# EAGLE design BaseBoard (EAGLE 9.5.1)
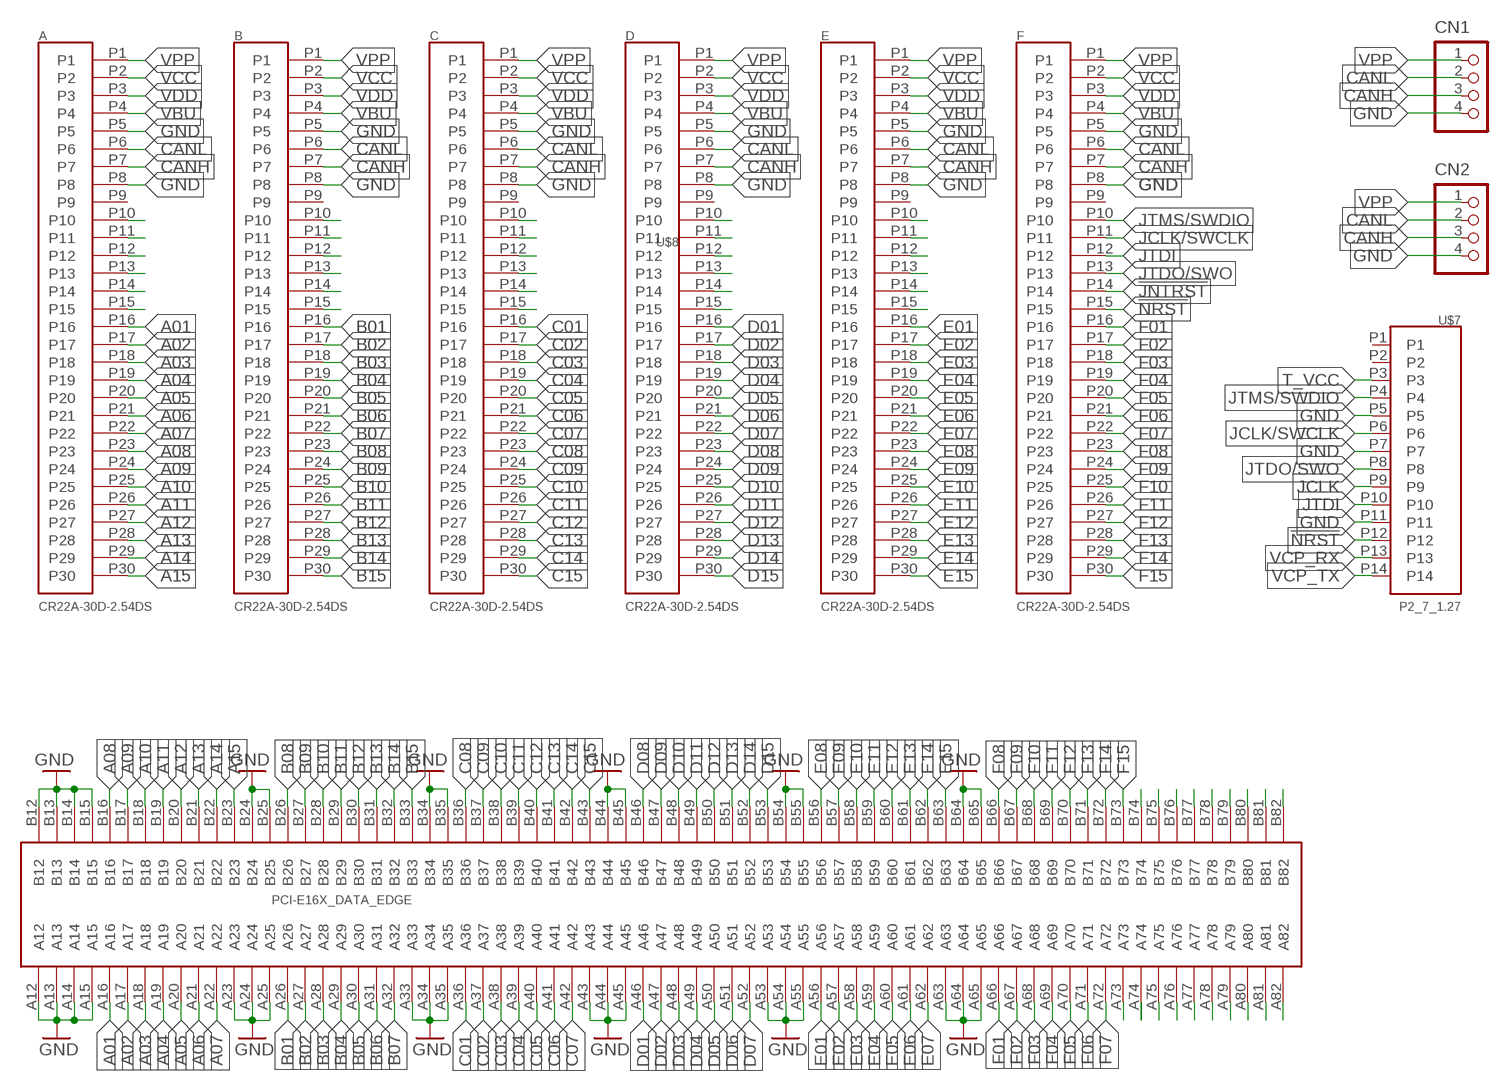
[diagram p0: schematic, sheet 1]

## Parts
A  CR22A-30D-2.54DS  [CR22A-30D-2.54DS]
B  CR22A-30D-2.54DS  [CR22A-30D-2.54DS]
C  CR22A-30D-2.54DS  [CR22A-30D-2.54DS]
CN1  B4B-PH-K-S  [B4B-PH-K-S]
CN2  B4B-PH-K-S  [B4B-PH-K-S]
D  CR22A-30D-2.54DS  [CR22A-30D-2.54DS]
E  CR22A-30D-2.54DS  [CR22A-30D-2.54DS]
F  CR22A-30D-2.54DS  [CR22A-30D-2.54DS]
U$7  P2_7_1.27  [P2_7_1.27]
U$8  PCI-E16X_DATA_EDGE  [PCI-E_164_DATA_EDGE]

## Nets
!JNTRST!: F.P14
!NRST!: F.P15 U$7.P12
A01: A.P16 U$8.A16
A02: A.P17 U$8.A17
A03: A.P18 U$8.A18
A04: A.P19 U$8.A19
A05: A.P20 U$8.A20
A06: A.P21 U$8.A21
A07: A.P22 U$8.A22
A08: A.P23 U$8.B16
A09: A.P24 U$8.B17
A10: A.P25 U$8.B18
A11: A.P26 U$8.B19
A12: A.P27 U$8.B20
A13: A.P28 U$8.B21
A14: A.P29 U$8.B22
A15: A.P30 U$8.B23
B01: B.P16 U$8.A26
B02: B.P17 U$8.A27
B03: B.P18 U$8.A28
B04: B.P19 U$8.A29
B05: B.P20 U$8.A30
B06: B.P21 U$8.A31
B07: B.P22 U$8.A32
B08: B.P23 U$8.B26
B09: B.P24 U$8.B27
B10: B.P25 U$8.B28
B11: B.P26 U$8.B29
B12: B.P27 U$8.B30
B13: B.P28 U$8.B31
B14: B.P29 U$8.B32
B15: B.P30 U$8.B33
C01: C.P16 U$8.A36
C02: C.P17 U$8.A37
C03: C.P18 U$8.A38
C04: C.P19 U$8.A39
C05: C.P20 U$8.A40
C06: C.P21 U$8.A41
C07: C.P22 U$8.A42
C08: C.P23 U$8.B36
C09: C.P24 U$8.B37
C10: C.P25 U$8.B38
C11: C.P26 U$8.B39
C12: C.P27 U$8.B40
C13: C.P28 U$8.B41
C14: C.P29 U$8.B42
C15: C.P30 U$8.B43
CANH: A.P7 B.P7 C.P7 CN1.3 CN2.3 D.P7 E.P7 F.P7
CANL: A.P6 B.P6 C.P6 CN1.2 CN2.2 D.P6 E.P6 F.P6
D01: D.P16 U$8.A46
D02: D.P17 U$8.A47
D03: D.P18 U$8.A48
D04: D.P19 U$8.A49
D05: D.P20 U$8.A50
D06: D.P21 U$8.A51
D07: D.P22 U$8.A52
D08: D.P23 U$8.B46
D09: D.P24 U$8.B47
D10: D.P25 U$8.B48
D11: D.P26 U$8.B49
D12: D.P27 U$8.B50
D13: D.P28 U$8.B51
D14: D.P29 U$8.B52
D15: D.P30 U$8.B53
E01: E.P16 U$8.A56
E02: E.P17 U$8.A57
E03: E.P18 U$8.A58
E04: E.P19 U$8.A59
E05: E.P20 U$8.A60
E06: E.P21 U$8.A61
E07: E.P22 U$8.A62
E08: E.P23 U$8.B56
E09: E.P24 U$8.B57
E10: E.P25 U$8.B58
E11: E.P26 U$8.B59
E12: E.P27 U$8.B60
E13: E.P28 U$8.B61
E14: E.P29 U$8.B62
E15: E.P30 U$8.B63
F01: F.P16 U$8.A66
F02: F.P17 U$8.A67
F03: F.P18 U$8.A68
F04: F.P19 U$8.A69
F05: F.P20 U$8.A70
F06: F.P21 U$8.A71
F07: F.P22 U$8.A72
F08: F.P23 U$8.B66
F09: F.P24 U$8.B67
F10: F.P25 U$8.B68
F11: F.P26 U$8.B69
F12: F.P27 U$8.B70
F13: F.P28 U$8.B71
F14: F.P29 U$8.B72
F15: F.P30 U$8.B73
GND: A.P5 A.P8 B.P5 B.P8 C.P5 C.P8 CN1.4 CN2.4 D.P5 D.P8 E.P5 E.P8 F.P5 F.P8 U$7.P5 U$7.P7 U$7.P11 U$8.A12 U$8.A13 U$8.A14 U$8.A15 U$8.A23 U$8.A24 U$8.A25 U$8.A33 U$8.A34 U$8.A35 U$8.A43 U$8.A44 U$8.A45 U$8.A53 U$8.A54 U$8.A55 U$8.A63 U$8.A64 U$8.A65 U$8.B12 U$8.B13 U$8.B14 U$8.B15 U$8.B24 U$8.B25 U$8.B34 U$8.B35 U$8.B44 U$8.B45 U$8.B54 U$8.B55 U$8.B64 U$8.B65
JCLK: U$7.P9
JCLK/SWCLK: F.P11 U$7.P6
JTDI: F.P12 U$7.P10
JTDO/SWO: F.P13 U$7.P8
JTMS/SWDIO: F.P10 U$7.P4
N$3: B.P10
N$4: B.P11
N$5: B.P12
N$6: B.P13
N$7: B.P14
N$8: B.P15
N$11: A.P10
N$12: A.P11
N$13: A.P12
N$14: A.P13
N$15: A.P14
N$16: A.P15
N$60: C.P10
N$61: C.P11
N$62: C.P12
N$63: C.P13
N$64: C.P14
N$65: C.P15
N$89: D.P10
N$90: D.P11
N$91: D.P12
N$92: D.P13
N$93: D.P14
N$94: D.P15
N$118: E.P10
N$119: E.P11
N$120: E.P12
N$121: E.P13
N$122: E.P14
N$123: E.P15
N$180: U$8.B74
N$181: U$8.B75
N$191: U$8.B76
N$192: U$8.B77
N$193: U$8.B78
N$194: U$8.B79
N$195: U$8.B80
N$196: U$8.B81
N$197: U$8.B82
N$259: U$8.A73
N$260: U$8.A74
N$262: U$8.A75
N$263: U$8.A76
N$264: U$8.A77
N$265: U$8.A78
N$266: U$8.A79
N$267: U$8.A80
N$268: U$8.A81
N$269: U$8.A82
T_VCC: U$7.P3
VBU: A.P4 B.P4 C.P4 D.P4 E.P4 F.P4
VCC: A.P2 B.P2 C.P2 D.P2 E.P2 F.P2
VCP_RX: U$7.P13
VCP_TX: U$7.P14
VDD: A.P3 B.P3 C.P3 D.P3 E.P3 F.P3
VPP: A.P1 B.P1 C.P1 CN1.1 CN2.1 D.P1 E.P1 F.P1
Unconnected: A.P9 B.P9 C.P9 D.P9 E.P9 F.P9 U$7.P1 U$7.P2

## Library data of the parts
A B C D E F = card_edge:CR22A-30D-2.54DS
CN1 CN2 = jst-ph:B4B-PH-*: Wire-to-Board 2.0mm pitch top mount connector Source: http://www.jst-mfg.com/product/pdf/jpn/PH.pdf http://www.jst-mfg.com/product/detail.php?series=199
U$7 = pins:P2_7_1.27
U$8 = con-pci_express(pci-e):PCI-E16X_DATA_EDGE

## Board
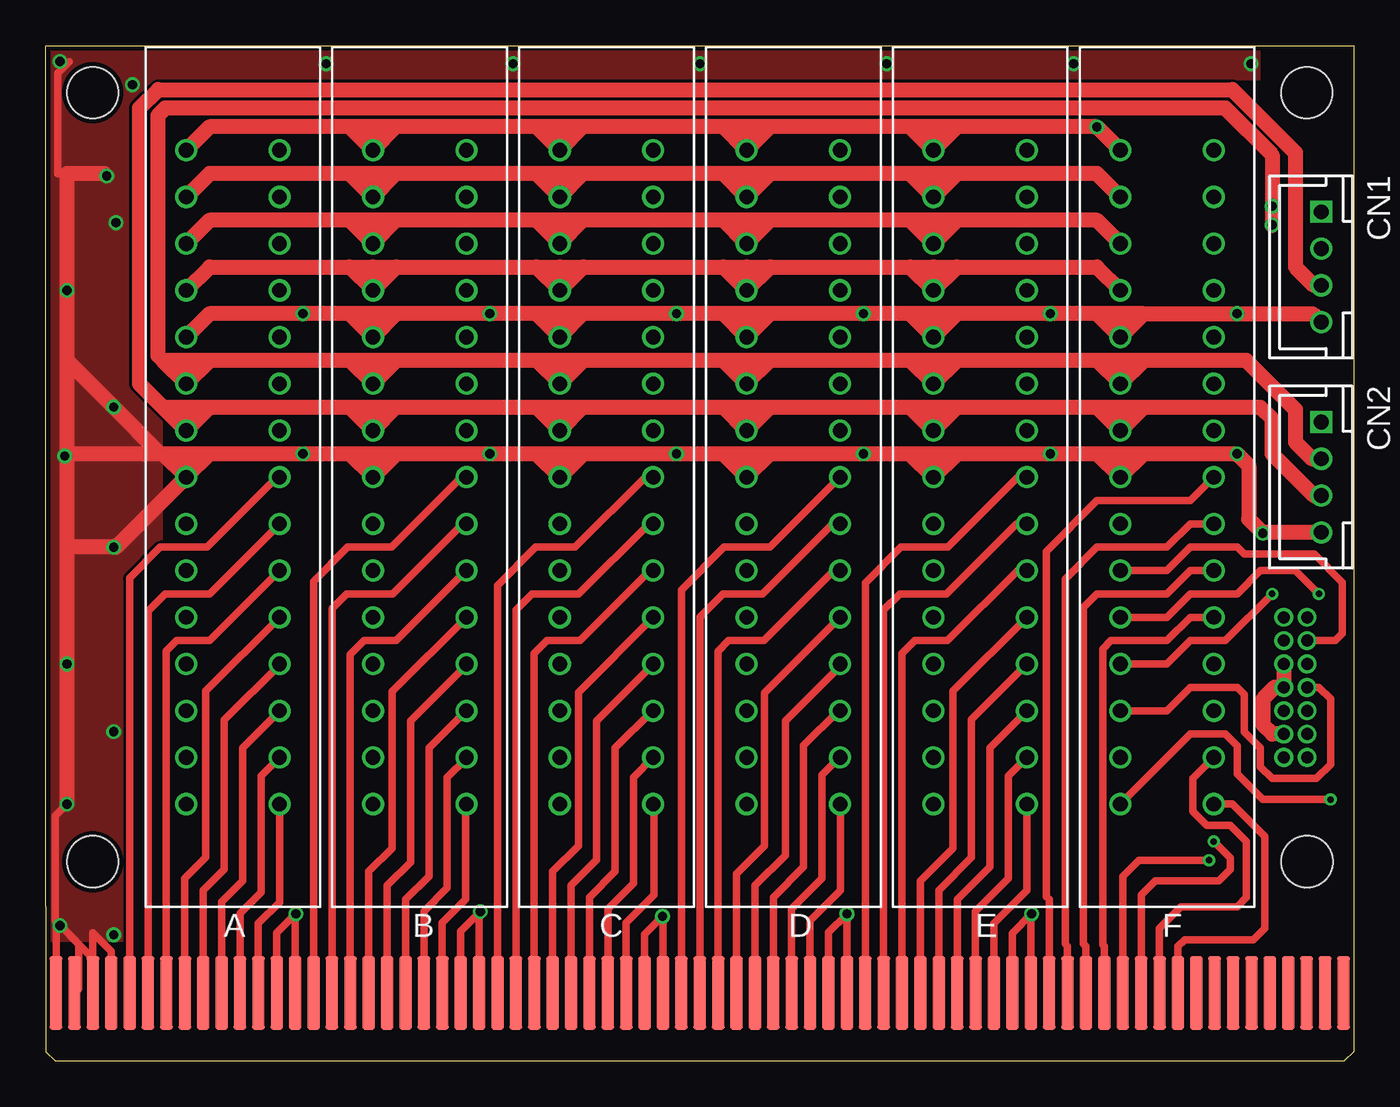
[diagram p1: board, top side]
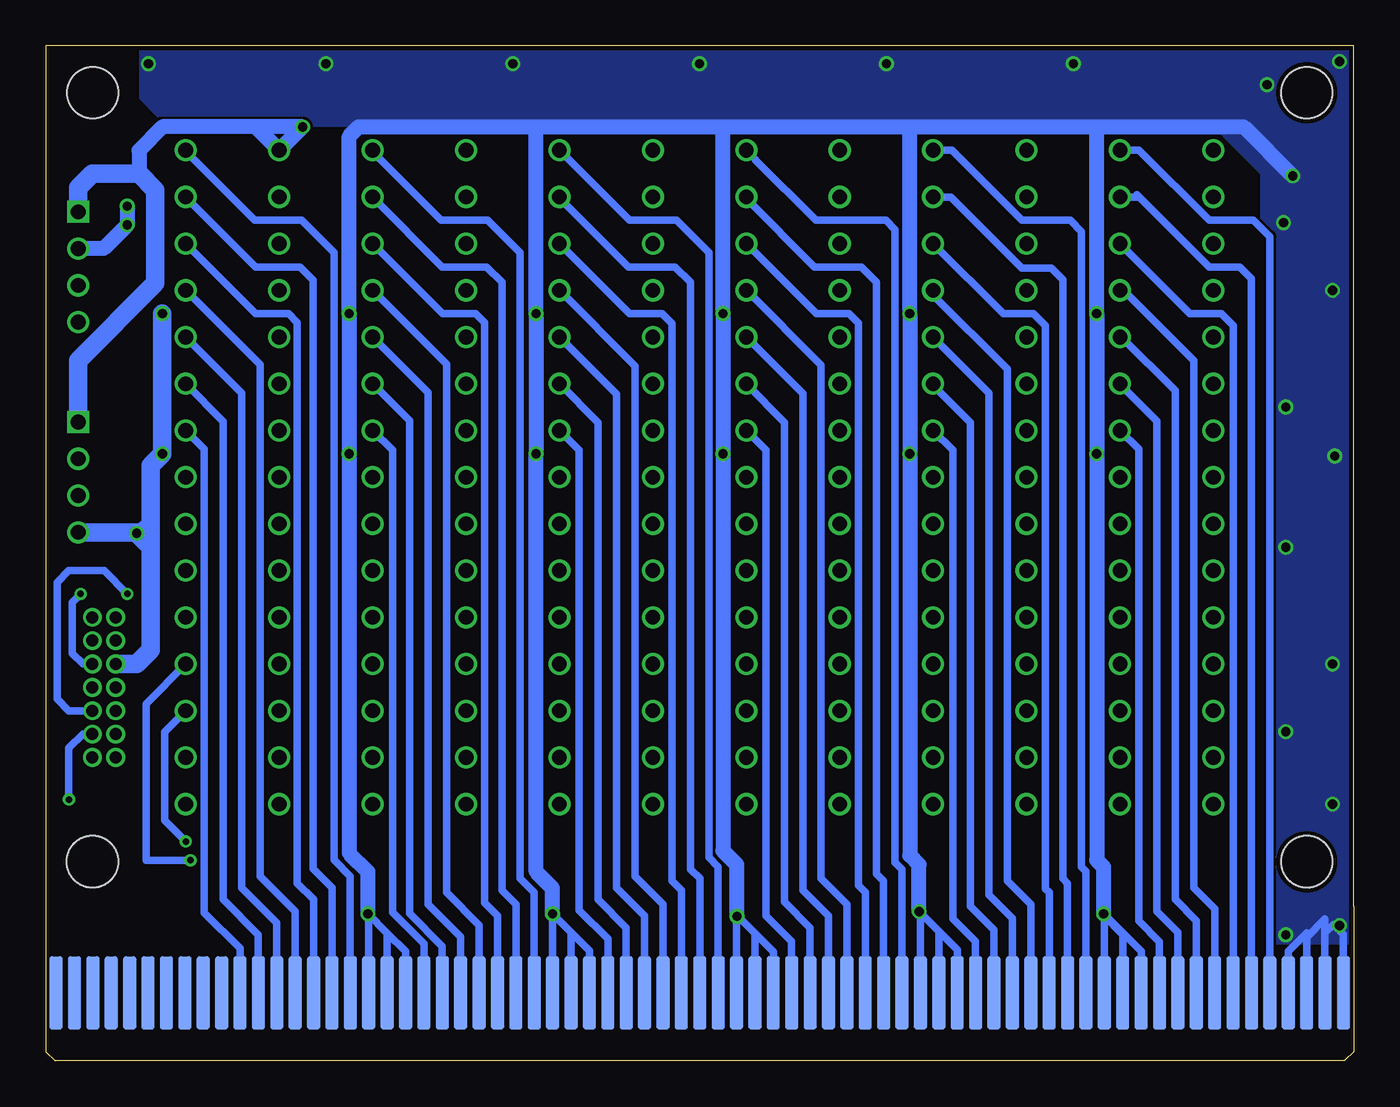
[diagram p2: board, bottom side, seen from below]

Size 71.1 x 55.2 mm. Coordinates in mm from the lower left corner, seen from the top.
Outline: 0,8.4 0,55.2 71.1,55.2 71.1,8.4
Copper layers (1*16): Top 0.035mm / dielectric 1.5mm / Bottom 0.035mm
Design rules "SeeedStudio_2layer_DRU_no_angle_20140221 *": minimum track width 6mil, minimum drill 12mil, track to track 6mil, track to pad 6mil, pad to pad 6mil, via to via 6mil, smd to smd 0mil, copper to edge 10mil, drill to drill 10mil, minimum pad ring 5mil, minimum via ring 6mil, stop-mask expansion 2mil, vias tented up to drill 100mil, thermal gap 10mil
Holes 2.8 mm at 68.56,52.66 68.58,10.84 2.54,52.66 2.54,10.84

### Footprints (pad centres in the part's own frame; a part is rotated, then mirrored left to right if it is on the bottom)
CR22A-30D-2.54DS = drill 0.8: P1 -2.54,17.78; P2 -2.54,15.24; P3 -2.54,12.7; P4 -2.54,10.16; P5 -2.54,7.62; P6 -2.54,5.08; P7 -2.54,2.54; P8 -2.54,0; P9 -2.54,-2.54; P10 -2.54,-5.08; P11 -2.54,-7.62; P12 -2.54,-10.16; P13 -2.54,-12.7; P14 -2.54,-15.24; P15 -2.54,-17.78; P16 2.54,17.78; P17 2.54,15.24; P18 2.54,12.7; P19 2.54,10.16; P20 2.54,7.62; P21 2.54,5.08; P22 2.54,2.54; P23 2.54,0; P24 2.54,-2.54; P25 2.54,-5.08; P26 2.54,-7.62; P27 2.54,-10.16; P28 2.54,-12.7; P29 2.54,-15.24; P30 2.54,-17.78
B4B-PH-K-S = drill 0.8 square: 1 -3,0 | drill 0.8: 2 -1,0; 3 1,0; 4 3,0
P2_7_1.27 = drill 0.65 pad 1.016: P1 0,3.81; P2 1.27,3.81; P3 0,2.54; P4 1.27,2.54; P5 0,1.27; P6 1.27,1.27; P7 0,0; P8 1.27,0; P9 0,-1.27; P10 1.27,-1.27; P11 0,-2.54; P12 1.27,-2.54; P13 0,-3.81; P14 1.27,-3.81
PCI-E_164_DATA_EDGE = smd 0.7 x 4 bottom: A12 0.55,3.7; A13 1.55,3.7; A14 2.55,3.7; A15 3.55,3.7; A16 4.55,3.7; A17 5.55,3.7; A18 6.55,3.7; A19 7.55,3.7; A20 8.55,3.7; A21 9.55,3.7; A22 10.55,3.7; A23 11.55,3.7; A24 12.55,3.7; A25 13.55,3.7; A26 14.55,3.7; A27 15.55,3.7; A28 16.55,3.7; A29 17.55,3.7; A30 18.55,3.7; A31 19.55,3.7; A32 20.55,3.7; A33 21.55,3.7; A34 22.55,3.7; A35 23.55,3.7; A36 24.55,3.7; A37 25.55,3.7; A38 26.55,3.7; A39 27.55,3.7; A40 28.55,3.7; A41 29.55,3.7; A42 30.55,3.7; A43 31.55,3.7; A44 32.55,3.7; A45 33.55,3.7; A46 34.55,3.7; A47 35.55,3.7; A48 36.55,3.7; A49 37.55,3.7; A50 38.55,3.7; A51 39.55,3.7; A52 40.55,3.7; A53 41.55,3.7; A54 42.55,3.7; A55 43.55,3.7; A56 44.55,3.7; A57 45.55,3.7; A58 46.55,3.7; A59 47.55,3.7; A60 48.55,3.7; A61 49.55,3.7; A62 50.55,3.7; A63 51.55,3.7; A64 52.55,3.7; A65 53.55,3.7; A66 54.55,3.7; A67 55.55,3.7; A68 56.55,3.7; A69 57.55,3.7; A70 58.55,3.7; A71 59.55,3.7; A72 60.55,3.7; A73 61.55,3.7; A74 62.55,3.7; A75 63.55,3.7; A76 64.55,3.7; A77 65.55,3.7; A78 66.55,3.7; A79 67.55,3.7; A80 68.55,3.7; A81 69.55,3.7; A82 70.55,3.7 | smd 0.7 x 4: B12 0.55,3.7; B13 1.55,3.7; B14 2.55,3.7; B15 3.55,3.7; B16 4.55,3.7; B17 5.55,3.7; B18 6.55,3.7; B19 7.55,3.7; B20 8.55,3.7; B21 9.55,3.7; B22 10.55,3.7; B23 11.55,3.7; B24 12.55,3.7; B25 13.55,3.7; B26 14.55,3.7; B27 15.55,3.7; B28 16.55,3.7; B29 17.55,3.7; B30 18.55,3.7; B31 19.55,3.7; B32 20.55,3.7; B33 21.55,3.7; B34 22.55,3.7; B35 23.55,3.7; B36 24.55,3.7; B37 25.55,3.7; B38 26.55,3.7; B39 27.55,3.7; B40 28.55,3.7; B41 29.55,3.7; B42 30.55,3.7; B43 31.55,3.7; B44 32.55,3.7; B45 33.55,3.7; B46 34.55,3.7; B47 35.55,3.7; B48 36.55,3.7; B49 37.55,3.7; B50 38.55,3.7; B51 39.55,3.7; B52 40.55,3.7; B53 41.55,3.7; B54 42.55,3.7; B55 43.55,3.7; B56 44.55,3.7; B57 45.55,3.7; B58 46.55,3.7; B59 47.55,3.7; B60 48.55,3.7; B61 49.55,3.7; B62 50.55,3.7; B63 51.55,3.7; B64 52.55,3.7; B65 53.55,3.7; B66 54.55,3.7; B67 55.55,3.7; B68 56.55,3.7; B69 57.55,3.7; B70 58.55,3.7; B71 59.55,3.7; B72 60.55,3.7; B73 61.55,3.7; B74 62.55,3.7; B75 63.55,3.7; B76 64.55,3.7; B77 65.55,3.7; B78 66.55,3.7; B79 67.55,3.7; B80 68.55,3.7; B81 69.55,3.7; B82 70.55,3.7

### Placement (x,y rotation side)
A  10.16,31.75 0 top
B  20.32,31.75 0 top
C  30.48,31.75 0 top
CN1  69.34,43.18 270 top
CN2  69.34,31.75 270 top
D  40.64,31.75 0 top
E  50.8,31.75 0 top
F  60.96,31.75 0 top
U$7  67.31,20.32 0 top
U$8  0,0 0 top

### Tracks (layer width: path | path; a pad name or v marks a point on that pad's centre or on a via)
!NRST!  (via drill 0.35)
  Top 0.406: F.P15 62.23,17.78 64.14,17.78 64.77,17.14 64.77,15.62 66.17,14.22 v69.85,14.22
  Bottom 0.406: v69.85,14.22 69.85,17.02 69.09,17.78 U$7.P12
A01
  Bottom 0.406: A.P16 11.66,49.53 7.85,45.72 5.44,45.72 4.55,44.83 U$8.A16
A02
  Bottom 0.406: A.P17 11.77,46.99 11.77,47.12 7.84,43.18 6.18,43.18 5.55,42.55 U$8.A17
A03
  Bottom 0.406: A.P18 8.89,40.64 7.18,40.64 6.55,40.01 U$8.A18
A04
  Bottom 0.406: A.P19 12.5,41.91 8.69,38.1 8.69,9.41 7.55,8.27 U$8.A19
A05
  Bottom 0.406: A.P20 12.61,39.37 9.69,36.45 9.69,8.78 8.55,7.64 U$8.A20
A06
  Bottom 0.406: A.P21 12.7,36.8 10.69,34.8 10.69,8.14 9.55,7 U$8.A21
A07
  Bottom 0.406: U$8.A22 10.55,6.49 11.68,7.62 11.68,33.27 A.P22
A08
  Top 0.406: A.P23 12.57,31.75 8.76,27.94 6.22,27.94 4.55,26.27 U$8.B16
A09
  Top 0.406: A.P24 8.89,25.4 6.48,25.4 5.55,24.47 U$8.B17
A10
  Top 0.406: U$8.B18 6.55,22.3 7.11,22.86 8.89,22.86 A.P25
A11
  Top 0.406: A.P26 8.69,20.12 8.69,11.07 7.55,9.92 U$8.B19
A12
  Top 0.406: A.P27 12.7,21.55 9.69,18.54 9.69,10.43 8.55,9.29 U$8.B20
A13
  Top 0.406: A.P28 12.7,19.02 10.69,17.02 10.69,9.8 9.55,8.65 U$8.B21
A14
  Top 0.406: A.P29 11.69,15.49 11.69,9.16 10.55,8.02 U$8.B22
A15
  Top 0.406: U$8.B23 11.55,7.49 12.7,8.64 A.P30
B01
  Bottom 0.406: B.P16 21.84,49.53 18.03,45.72 15.41,45.72 14.8,45.12 14.8,10.56 14.55,10.3 U$8.A26
B02
  Bottom 0.406: B.P17 21.9,46.99 18.03,43.12 16.42,43.12 15.8,42.5 15.8,9.92 15.55,9.67 U$8.A27
B03
  Bottom 0.406: B.P18 19.05,40.64 17.4,40.64 16.76,40.01 16.76,9.38 16.55,9.16 U$8.A28
B04
  Bottom 0.406: B.P19 22.86,41.66 18.82,37.62 18.82,9.8 17.55,8.53 U$8.A29
B05
  Bottom 0.406: B.P20 19.82,36.33 19.82,9.03 18.55,7.76 U$8.A30
B06
  Bottom 0.406: B.P21 22.86,36.77 20.82,34.73 20.82,8.4 19.55,7.13 U$8.A31
B07
  Bottom 0.406: B.P22 21.78,33.21 21.78,7.74 20.55,6.51 U$8.A32
B08
  Top 0.406: B.P23 22.59,31.75 18.78,27.94 16.41,27.94 14.55,26.07 U$8.B26
B09
  Top 0.406: B.P24 22.65,29.21 18.84,25.4 16.35,25.4 15.55,24.6 U$8.B27
B10
  Top 0.406: B.P25 22.84,26.67 19.03,22.86 17.3,22.86 16.55,22.11 U$8.B28
B11
  Top 0.406: B.P26 18.82,20.09 18.82,11.57 17.55,10.3 U$8.B29
B12
  Top 0.406: B.P27 22.86,21.54 19.82,18.5 19.82,10.81 18.55,9.54 U$8.B30
B13
  Top 0.406: B.P28 22.84,19.05 20.82,17.03 20.82,10.05 19.55,8.78 U$8.B31
B14
  Top 0.406: B.P29 22.86,16.47 21.82,15.43 21.82,9.41 20.55,8.14 U$8.B32
B15
  Top 0.406: B.P30 22.82,13.93 22.82,8.78 21.55,7.51 U$8.B33
C01
  Bottom 0.406: C.P16 32.51,49.02 32.51,48.99 29.24,45.72 25.43,45.72 24.93,45.22 24.93,10.81 24.55,10.43 U$8.A36
C02
  Bottom 0.406: C.P17 33.02,46.9 29.3,43.18 26.76,43.18 25.93,42.35 25.93,10.18 25.55,9.8 U$8.A37
C03
  Bottom 0.406: C.P18 29.21,40.64 27.43,40.64 26.93,40.14 26.93,9.54 26.55,9.16 U$8.A38
C04
  Bottom 0.406: C.P19 28.95,37.84 28.95,9.92 27.55,8.53 U$8.A39
C05
  Bottom 0.406: C.P20 29.95,36.3 29.95,9.29 28.55,7.89 U$8.A40
C06
  Bottom 0.406: C.P21 33.02,36.8 30.95,34.73 30.95,8.65 29.55,7.26 U$8.A41
C07
  Bottom 0.406: C.P22 31.94,33.21 31.94,7.9 30.55,6.51 U$8.A42
C08
  Top 0.406: C.P23 32.59,31.75 28.78,27.94 26.62,27.94 24.55,25.87 U$8.B36
C09
  Top 0.406: C.P24 32.78,29.21 28.97,25.4 26.43,25.4 25.55,24.52 U$8.B37
C10
  Top 0.406: C.P25 32.84,26.67 29.03,22.86 27.25,22.86 26.55,22.16 U$8.B38
C11
  Top 0.406: C.P26 28.95,20.06 28.95,11.7 27.55,10.3 U$8.B39
C12
  Top 0.406: C.P27 33.02,21.57 29.95,18.5 29.95,10.94 28.55,9.54 U$8.B40
C13
  Top 0.406: C.P28 32.97,19.05 30.95,17.03 30.95,10.3 29.55,8.91 U$8.B41
C14
  Top 0.406: C.P29 31.95,15.43 31.95,9.67 30.55,8.27 U$8.B42
C15
  Top 0.406: C.P30 33.07,13.92 33.07,9.03 31.55,7.51 U$8.B43
CANH
  Top 0.813: CN2.3 68.94,30.75 66.67,33.02 66.67,34.92 66.04,35.56 59.69,35.56 | 6.35,35.56 5.08,36.83 5.08,51.82 6.1,52.83 64.52,52.83 67.94,49.4 67.94,43.18 68.94,42.18 CN1.3 | 6.35,35.56 7.62,35.56 | 7.62,35.56 8.89,35.56 | 8.89,35.56 16.51,35.56 | 16.51,35.56 17.78,35.56 | 17.78,35.56 19.05,35.56 | 19.05,35.56 26.67,35.56 | 26.67,35.56 27.94,35.56 | 27.94,35.56 29.21,35.56 | 29.21,35.56 36.83,35.56 | 36.83,35.56 38.1,35.56 | 38.1,35.56 39.37,35.56 | 39.37,35.56 46.99,35.56 | 46.99,35.56 48.26,35.56 | 48.26,35.56 49.53,35.56 | 49.53,35.56 57.15,35.56 | 57.15,35.56 58.42,35.56 | 58.42,35.56 59.69,35.56 | F.P7 58.42,35.56 | F.P7 59.69,35.56 | F.P7 57.15,35.56 | E.P7 48.26,35.56 | E.P7 49.53,35.56 | E.P7 46.99,35.56 | 39.37,35.56 D.P7 | D.P7 36.83,35.56 | 38.1,35.56 D.P7 | C.P7 27.94,35.56 | C.P7 29.21,35.56 | 26.67,35.56 C.P7 | B.P7 19.05,35.56 | 17.78,35.56 B.P7 | B.P7 16.51,35.56 | A.P7 6.35,35.56 | 7.62,35.56 A.P7 | A.P7 8.89,35.56
CANL  (via drill 0.5)
  Top 0.813: CN2.2 68.85,32.75 67.94,33.66 67.94,35.43 65.28,38.1 59.69,38.1 | 66.67,45.45 v66.67,45.47 v66.67,46.48 66.67,49.28 64.14,51.82 6.48,51.82 6.1,51.44 6.1,38.35 6.35,38.1 | 59.69,38.1 58.42,38.1 | 58.42,38.1 57.15,38.1 | 57.15,38.1 49.53,38.1 | 49.53,38.1 48.26,38.1 | 48.26,38.1 46.99,38.1 | 46.99,38.1 39.37,38.1 | 39.37,38.1 38.1,38.1 | 38.1,38.1 36.83,38.1 | 36.83,38.1 29.21,38.1 | 29.21,38.1 27.94,38.1 | 27.94,38.1 26.67,38.1 | 26.67,38.1 19.05,38.1 | 19.05,38.1 17.78,38.1 | 17.78,38.1 16.51,38.1 | 16.51,38.1 8.89,38.1 | 8.89,38.1 7.62,38.1 | 7.62,38.1 6.35,38.1 | F.P6 59.69,38.1 | 58.42,38.1 F.P6 | F.P6 57.15,38.1 | E.P6 49.53,38.1 | 48.26,38.1 E.P6 | E.P6 46.99,38.1 | 39.37,38.1 D.P6 | D.P6 38.1,38.1 | 36.83,38.1 D.P6 | C.P6 29.21,38.1 | 27.94,38.1 C.P6 | C.P6 26.67,38.1 | B.P6 19.05,38.1 | 17.78,38.1 B.P6 | B.P6 16.51,38.1 | A.P6 8.89,38.1 | A.P6 7.62,38.1 | 6.35,38.1 A.P6
  Bottom 0.813: v66.67,46.48 v66.67,45.47 67.96,44.18 CN1.2
D01
  Bottom 0.406: D.P16 39.37,45.72 36.83,45.72 35.06,43.95 35.06,11.07 34.55,10.56 U$8.A46
D02
  Bottom 0.406: D.P17 43.18,46.93 39.43,43.18 36.89,43.18 36.06,42.35 36.06,10.43 35.55,9.92 U$8.A47
D03
  Bottom 0.406: D.P18 39.37,40.64 37.59,40.64 37.06,40.11 37.06,9.8 36.55,9.29 U$8.A48
D04
  Bottom 0.406: D.P19 39.07,37.8 39.07,10.05 37.55,8.53 U$8.A49
D05
  Bottom 0.406: D.P20 40.07,36.26 40.07,9.41 38.55,7.89 U$8.A50
D06
  Bottom 0.406: D.P21 41.07,34.72 41.07,8.78 39.55,7.26 U$8.A51
D07
  Bottom 0.406: D.P22 42.1,33.21 42.1,8.19 40.55,6.63 U$8.A52
D08
  Top 0.406: D.P23 39.37,27.94 36.88,27.94 34.55,25.61 U$8.B46
D09
  Top 0.406: D.P24 42.78,29.21 38.97,25.4 36.81,25.4 35.55,24.14 U$8.B47
D10
  Top 0.406: D.P25 42.84,26.67 39.03,22.86 37.12,22.86 36.55,22.29 U$8.B48
D11
  Top 0.406: D.P26 39.07,20.02 39.07,11.7 37.55,10.18 U$8.B49
D12
  Top 0.406: D.P27 43.18,21.46 40.2,18.48 40.2,11.19 38.55,9.54 U$8.B50
D13
  Top 0.406: D.P28 43.1,19.05 41.2,17.16 41.2,10.56 39.55,8.91 U$8.B51
D14
  Top 0.406: D.P29 43.16,16.51 42.2,15.55 42.2,9.92 40.55,8.27 U$8.B52
D15
  Top 0.406: D.P30 43.2,13.95 43.2,9.29 41.55,7.64 U$8.B53
E01
  Bottom 0.406: E.P16 53.34,49.44 49.62,45.72 47.08,45.72 45.31,43.95 45.31,9.92 44.55,9.16 U$8.A56
E02
  Bottom 0.406: E.P17 53.34,46.97 49.55,43.18 47.14,43.18 46.31,42.35 46.31,9.29 45.55,8.53 U$8.A57
E03
  Bottom 0.406: E.P18 49.53,40.64 47.75,40.64 47.26,40.15 47.26,8.61 46.55,7.9 U$8.A58
E04
  Bottom 0.406: E.P19 49.33,37.9 49.33,9.16 47.55,7.38 U$8.A59
E05
  Bottom 0.406: E.P20 50.33,36.36 50.33,8.53 48.55,6.75 U$8.A60
E06
  Bottom 0.406: E.P21 51.33,34.82 51.33,8.02 49.55,6.24 U$8.A61
E07
  Bottom 0.406: E.P22 52.26,33.21 52.26,8.09 50.55,6.38 U$8.A62
E08
  Top 0.406: E.P23 52.85,31.75 49.04,27.94 46.5,27.94 44.55,25.99 U$8.B56
E09
  Top 0.406: E.P24 52.78,29.21 48.97,25.4 46.43,25.4 45.55,24.52 U$8.B57
E10
  Top 0.406: E.P25 52.84,26.67 49.03,22.86 47.25,22.86 46.55,22.16 U$8.B58
E11
  Top 0.406: E.P26 49.33,20.12 49.33,11.57 47.55,9.8 U$8.B59
E12
  Top 0.406: E.P27 50.33,18.58 50.33,11.07 48.55,9.29 U$8.B60
E13
  Top 0.406: E.P28 51.33,17.03 51.33,10.56 49.55,8.78 U$8.B61
E14
  Top 0.406: E.P29 52.33,15.5 52.33,9.92 50.55,8.14 U$8.B62
E15
  Top 0.406: E.P30 53.34,9.27 51.55,7.48 U$8.B63
F01
  Bottom 0.406: F.P16 63.5,49.47 59.75,45.72 57.21,45.72 55.44,43.95 55.44,10.94 54.55,10.05 U$8.A66
F02
  Bottom 0.406: F.P17 59.69,43.18 57.28,43.18 56.58,42.48 56.58,10.44 55.55,9.41 U$8.A67
F03
  Bottom 0.406: F.P18 59.69,40.64 57.91,40.64 57.44,40.17 57.44,9.67 56.55,8.78 U$8.A68
F04
  Bottom 0.406: F.P19 59.45,37.87 59.45,10.05 57.55,8.14 U$8.A69
F05
  Bottom 0.406: F.P20 60.45,36.33 60.45,9.41 58.55,7.51 U$8.A70
F06
  Bottom 0.406: F.P21 61.45,34.78 61.45,8.78 59.55,6.88 U$8.A71
F07
  Bottom 0.406: F.P22 62.48,33.27 62.48,8.06 60.55,6.13 U$8.A72
F08
  Top 0.406: F.P23 62.23,30.48 57.15,30.48 54.39,27.72 54.39,8.94 54.55,8.78 U$8.B66
F09
  Top 0.406: F.P24 62.23,29.21 60.96,27.94 57.15,27.94 55.42,26.21 55.42,6.37 55.55,6.24 U$8.B67
F10
  Top 0.406: F.P25 62.23,26.67 60.96,25.4 57.15,25.4 56.42,24.67 56.42,6.37 56.55,6.24 U$8.B68
F11
  Top 0.406: F.P26 62.23,24.13 60.96,22.86 57.91,22.86 57.46,22.41 57.46,6.33 57.55,6.24 U$8.B69
F12  (via drill 0.35)
  Top 0.406: v63.25,10.92 59.44,10.92 58.55,10.04 U$8.B70
  Bottom 0.406: F.P27 65.66,19.43 65.66,10.92 v63.25,10.92
F13  (via drill 0.35)
  Top 0.406: v63.5,11.94 64.39,11.05 64.39,10.41 63.77,9.8 60.31,9.8 59.55,9.03 U$8.B71
  Bottom 0.406: F.P28 64.64,17.91 64.64,13.08 v63.5,11.94
F14
  Top 0.406: F.P29 62.36,15.37 62.36,13.59 63.12,12.83 64.39,12.83 65.28,11.94 65.28,8.89 64.77,8.38 61.72,8.38 60.55,7.21 U$8.B72
F15
  Top 0.406: F.P30 64.52,13.97 66.26,12.22 66.26,7.21 65.66,6.6 61.91,6.6 61.55,6.24 U$8.B73
GND  (via drill 0.5)
  Top 0.406: U$8.A24 12.55,6.96 v13.59,8 13.55,7.96 U$8.A25 | U$8.B34 22.55,7.06 v23.62,8.13 23.55,8.06 U$8.B35 | U$8.B44 32.55,6.9 v33.53,7.87 33.55,7.85 U$8.B45 | U$8.B13 1.78,3.93 1.78,6.35 v0.76,7.37 | U$8.B12 0.55,7.15 v0.76,7.37 | U$8.B14 2.55,5.58 | 2.55,5.58 2.55,6.97 3.55,5.97 U$8.B15 | 2.55,5.58 v0.76,7.37 | v0.76,7.37 0.51,7.62 0.51,13.34 v1.14,13.97 | 1.27,54.36 0.64,53.72 0.64,48.26 1.14,48.26 | U$8.B64 52.55,6.96 v53.59,8 53.55,7.96 U$8.B65 | v43.55,7.99 v43.56,8 | U$8.B55 v43.55,7.99 | U$8.B54 42.55,6.99 v43.55,7.99
  Top 0.813: U$7.P11 66.67,17.78 66.17,18.29 66.17,19.68 66.8,20.32 U$7.P7 U$7.P5 | A.P5 8.89,40.64 v13.97,40.64 16.51,40.64 | 59.69,40.64 58.42,40.64 | 58.42,40.64 57.15,40.64 | 57.15,40.64 v54.61,40.64 49.53,40.64 | 49.53,40.64 48.26,40.64 | 48.26,40.64 46.99,40.64 | 46.99,40.64 v44.45,40.64 39.37,40.64 | 39.37,40.64 38.1,40.64 | 38.1,40.64 36.83,40.64 | 36.83,40.64 v34.29,40.64 29.21,40.64 | 29.21,40.64 27.94,40.64 | 27.94,40.64 26.67,40.64 | 26.67,40.64 v24.13,40.64 19.05,40.64 | 19.05,40.64 17.78,40.64 | 17.78,40.64 16.51,40.64 | 8.89,33.02 A.P8 | 59.69,33.02 v64.77,33.02 65.41,32.38 65.41,29.46 v66.17,28.7 66.22,28.75 CN2.4 | 59.69,33.02 58.42,33.02 | 58.42,33.02 57.15,33.02 | 57.15,33.02 v54.61,33.02 49.53,33.02 | 49.53,33.02 48.26,33.02 | 48.26,33.02 46.99,33.02 | 46.99,33.02 v44.45,33.02 39.37,33.02 | 39.37,33.02 38.1,33.02 | 38.1,33.02 36.83,33.02 | 36.83,33.02 v34.29,33.02 29.21,33.02 | 29.21,33.02 27.94,33.02 | 27.94,33.02 26.67,33.02 | 26.67,33.02 v24.13,33.02 19.05,33.02 | 19.05,33.02 17.78,33.02 | 17.78,33.02 16.51,33.02 | 16.51,33.02 v13.97,33.02 8.89,33.02 | 17.78,40.64 B.P5 | B.P5 16.51,40.64 | 19.05,40.64 B.P5 | C.P5 26.67,40.64 | C.P5 27.94,40.64 | C.P5 29.21,40.64 | D.P5 36.83,40.64 | D.P5 38.1,40.64 | D.P5 39.37,40.64 | E.P5 46.99,40.64 | E.P5 48.26,40.64 | E.P5 49.53,40.64 | F.P5 57.15,40.64 | F.P5 58.42,40.64 | F.P5 59.69,40.64 | B.P8 19.05,33.02 | 17.78,33.02 B.P8 | B.P8 16.51,33.02 | 26.67,33.02 C.P8 | C.P8 27.94,33.02 | 29.21,33.02 C.P8 | 36.83,33.02 D.P8 | D.P8 38.1,33.02 | 39.37,33.02 D.P8 | E.P8 48.26,33.02 | 46.99,33.02 E.P8 | E.P8 49.53,33.02 | 58.42,33.02 F.P8 | F.P8 57.15,33.02 | 59.69,33.02 F.P8 | v1.14,13.97 v1.14,21.59 1.14,27.94 | 1.14,27.94 1.14,33.02
  Top 0.813: 1.14,33.02 1.14,38.1 | 1.14,38.1 v1.14,41.91 1.14,48.26 3.17,48.26 v3.3,48.13 | A.P8 3.81,27.94 v3.68,27.94 1.14,27.94 | 8.89,33.02 7.62,33.02 | 7.62,33.02 6.35,33.02 | 6.22,33.02 1.14,33.02 | A.P8 6.35,33.02 | 6.35,33.02 6.22,33.02 | 6.22,33.02 v3.68,35.56 1.14,38.1 | A.P8 7.62,33.02 | 59.69,40.64 v64.77,40.64 68.88,40.64 CN1.4
  Bottom 0.406: U$8.A24 12.55,6.88 13.59,7.91 v13.59,8 | v13.59,8 13.55,7.96 U$8.A25 | U$8.A23 11.55,5.96 v13.59,8 | U$8.B34 22.55,7.06 v23.62,8.13 | v23.62,8.13 21.55,6.06 U$8.A33 | v23.62,8.13 23.55,8.06 U$8.B35 | U$8.B44 32.55,6.95 | U$8.A43 31.55,5.95 32.55,6.95 | 32.55,6.95 33.5,7.9 v33.53,7.87 33.55,7.85 U$8.B45 | U$8.B54 42.55,6.99 v43.56,8 | v43.56,8 41.55,5.99 U$8.A53 | v43.56,8 v43.55,7.99 U$8.B55 | U$8.B15 3.55,5.97 2.55,6.97 2.55,6.72 | 0.76,7.11 v0.76,7.37 | U$8.B14 2.55,6.72 | 2.55,6.72 1.55,7.72 1.55,6.96 | 1.55,6.96 1.08,7.43 0.76,7.11 | U$8.B13 1.55,6.96 | U$8.B12 0.55,6.9 0.76,7.11 | U$8.B64 52.55,6.96 | 52.55,6.96 v53.59,8 53.55,7.96 U$8.B65 | U$8.A63 51.55,5.96 52.55,6.96
  Bottom 0.813: v13.59,8 13.59,10.54 13.97,10.92 v13.97,33.02 v13.97,40.64 13.97,50.8 | v23.62,8.13 23.62,10.67 24.13,11.18 v24.13,33.02 v24.13,40.64 24.13,50.8 | 24.13,50.8 13.97,50.8 | v33.53,7.87 33.53,10.67 34.29,11.43 v34.29,33.02 v34.29,40.64 34.29,50.8 | 34.29,50.8 24.13,50.8 | v43.56,8 43.56,9.4 44.45,10.29 v44.45,33.02 v44.45,40.64 44.45,50.8 | 44.45,50.8 34.29,50.8 | 13.97,50.8 5.97,50.8 v3.3,48.13 | v53.59,8 53.59,10.29 54.61,11.3 v54.61,33.02 v54.61,40.64 54.61,50.29 54.1,50.8 44.45,50.8
  Bottom 1.016: U$7.P5 66.17,21.59 65.41,22.35 65.41,27.94 | 65.41,27.94 v66.17,28.7 | v66.17,28.7 66.22,28.75 CN2.4 | v64.77,40.64 v64.77,33.02 65.41,32.38 65.41,29.21 | 65.41,29.21 65.41,27.94 | v66.17,28.7 65.91,28.7 65.41,29.21
  other vias: 3.68,6.86 3.81,45.59 3.68,17.91 1.02,32.89 0.76,54.36 4.7,53.09 15.24,54.23 25.4,54.23 35.56,54.23 45.72,54.23 55.88,54.23 65.53,54.23
  pour Bottom: 3.81,6.35 0,6.35 0,54.61 0,55.88 66.04,55.88 66.04,53.34 66.04,52.32 65.02,51.31 64.52,50.8 46.99,50.8 7.62,50.8 5.08,48.26 5.08,38.1 5.08,6.35
  pour Top: 6.35,6.48 0,6.48 0,55.88 66.04,55.88 66.04,53.34 64.77,53.34 63.5,52.07 6.35,52.07
JCLK/SWCLK  (via drill 0.35)
  Top 0.406: F.P11 60.96,24.13 62.23,25.4 64.77,25.4 66.04,26.67 67.94,26.67 v69.22,25.4
  Bottom 0.406: v69.22,25.4 69.67,24.94 69.67,22.18 69.09,21.59 U$7.P6
JTDI  (via drill 0.35)
  Top 0.406: F.P12 60.96,21.59 62.23,22.86 64.14,22.86 v66.67,25.4
  Bottom 0.406: v66.67,25.4 67.94,26.67 69.85,26.67 70.49,26.03 70.49,19.69 69.85,19.05 U$7.P10
JTDO/SWO
  Top 0.406: F.P13 60.96,19.05 62.23,20.32 64.77,20.32 65.15,19.94 65.15,17.91 66.04,17.02 66.04,16 66.67,15.37 69.09,15.37 69.85,16.13 69.85,19.68 69.22,20.32 U$7.P8
JTMS/SWDIO
  Top 0.406: F.P10 60.96,26.67 62.23,27.94 64.77,27.94 65.15,27.56 68.96,27.56 70.48,26.04 70.48,23.24 70.1,22.86 U$7.P4
VBU
  Top 0.813: A.P4 8.89,43.18 16.51,43.18 | 16.51,43.18 17.78,43.18 | 17.78,43.18 19.05,43.18 | 19.05,43.18 26.67,43.18 | 26.67,43.18 27.94,43.18 | 27.94,43.18 29.21,43.18 | 29.21,43.18 36.83,43.18 | 36.83,43.18 38.1,43.18 | 38.1,43.18 39.37,43.18 | 39.37,43.18 46.99,43.18 | 46.99,43.18 48.26,43.18 | 48.26,43.18 49.53,43.18 | 49.53,43.18 57.15,43.18 F.P4 | E.P4 49.53,43.18 | E.P4 48.26,43.18 | 46.99,43.18 E.P4 | D.P4 39.37,43.18 | 38.1,43.18 D.P4 | D.P4 36.83,43.18 | 29.21,43.18 C.P4 | C.P4 27.94,43.18 | 26.67,43.18 C.P4 | B.P4 19.05,43.18 | 17.78,43.18 B.P4 | B.P4 16.51,43.18
VCC
  Top 0.813: F.P2 57.15,48.26 49.53,48.26 | 49.53,48.26 48.26,48.26 | 48.26,48.26 46.99,48.26 | 46.99,48.26 39.37,48.26 | 39.37,48.26 38.1,48.26 | 38.1,48.26 36.83,48.26 | 36.83,48.26 29.21,48.26 | 29.21,48.26 27.94,48.26 | 27.94,48.26 26.67,48.26 | 26.67,48.26 19.05,48.26 | 19.05,48.26 17.78,48.26 | 17.78,48.26 16.51,48.26 | 16.51,48.26 8.89,48.26 A.P2 | B.P2 19.05,48.26 | B.P2 16.51,48.26 | B.P2 17.78,48.26 | C.P2 27.94,48.26 | C.P2 26.67,48.26 | C.P2 29.21,48.26 | D.P2 36.83,48.26 | D.P2 38.1,48.26 | D.P2 39.37,48.26 | E.P2 48.26,48.26 | E.P2 46.99,48.26 | E.P2 49.53,48.26
VDD
  Top 0.813: F.P3 57.15,45.72 49.53,45.72 | 49.53,45.72 48.26,45.72 | 48.26,45.72 46.99,45.72 | 46.99,45.72 39.37,45.72 | 39.37,45.72 38.1,45.72 | 38.1,45.72 36.83,45.72 | 36.83,45.72 29.21,45.72 | 29.21,45.72 27.94,45.72 | 27.94,45.72 26.67,45.72 | 26.67,45.72 19.05,45.72 | 19.05,45.72 17.78,45.72 | 17.78,45.72 16.51,45.72 | 16.51,45.72 8.89,45.72 A.P3 | B.P3 16.51,45.72 | B.P3 17.78,45.72 | B.P3 19.05,45.72 | C.P3 26.67,45.72 | C.P3 27.94,45.72 | C.P3 29.21,45.72 | D.P3 36.83,45.72 | D.P3 38.1,45.72 | D.P3 39.37,45.72 | E.P3 46.99,45.72 | E.P3 48.26,45.72 | E.P3 49.53,45.72
VPP  (via drill 0.5)
  Top 0.813: F.P1 v57.15,50.8 49.53,50.8 | 49.53,50.8 48.26,50.8 | 48.26,50.8 46.99,50.8 | 46.99,50.8 39.37,50.8 | 39.37,50.8 38.1,50.8 | 38.1,50.8 36.83,50.8 | 36.83,50.8 29.21,50.8 | 29.21,50.8 27.94,50.8 | 27.94,50.8 26.67,50.8 | 26.67,50.8 19.05,50.8 | 19.05,50.8 17.78,50.8 | 17.78,50.8 16.51,50.8 | 16.51,50.8 8.89,50.8 A.P1 | B.P1 17.78,50.8 | 16.51,50.8 B.P1 | B.P1 19.05,50.8 | C.P1 26.67,50.8 | 27.94,50.8 C.P1 | C.P1 29.21,50.8 | 38.1,50.8 D.P1 | D.P1 36.83,50.8 | 39.37,50.8 D.P1 | 46.99,50.8 E.P1 | E.P1 48.26,50.8 | 49.53,50.8 E.P1
  Bottom 0.813: 59.69,50.8 F.P1 v57.15,50.8 59.69,50.8 | 59.69,50.8 64.77,50.8 66.04,49.53 66.04,48.26
  Bottom 1.016: CN2.1 69.34,38.1 65.15,42.29 65.15,47.37 66.04,48.26 68.58,48.26 69.34,47.5 CN1.1